# EAGLE design Main (EAGLE 9.2.2)
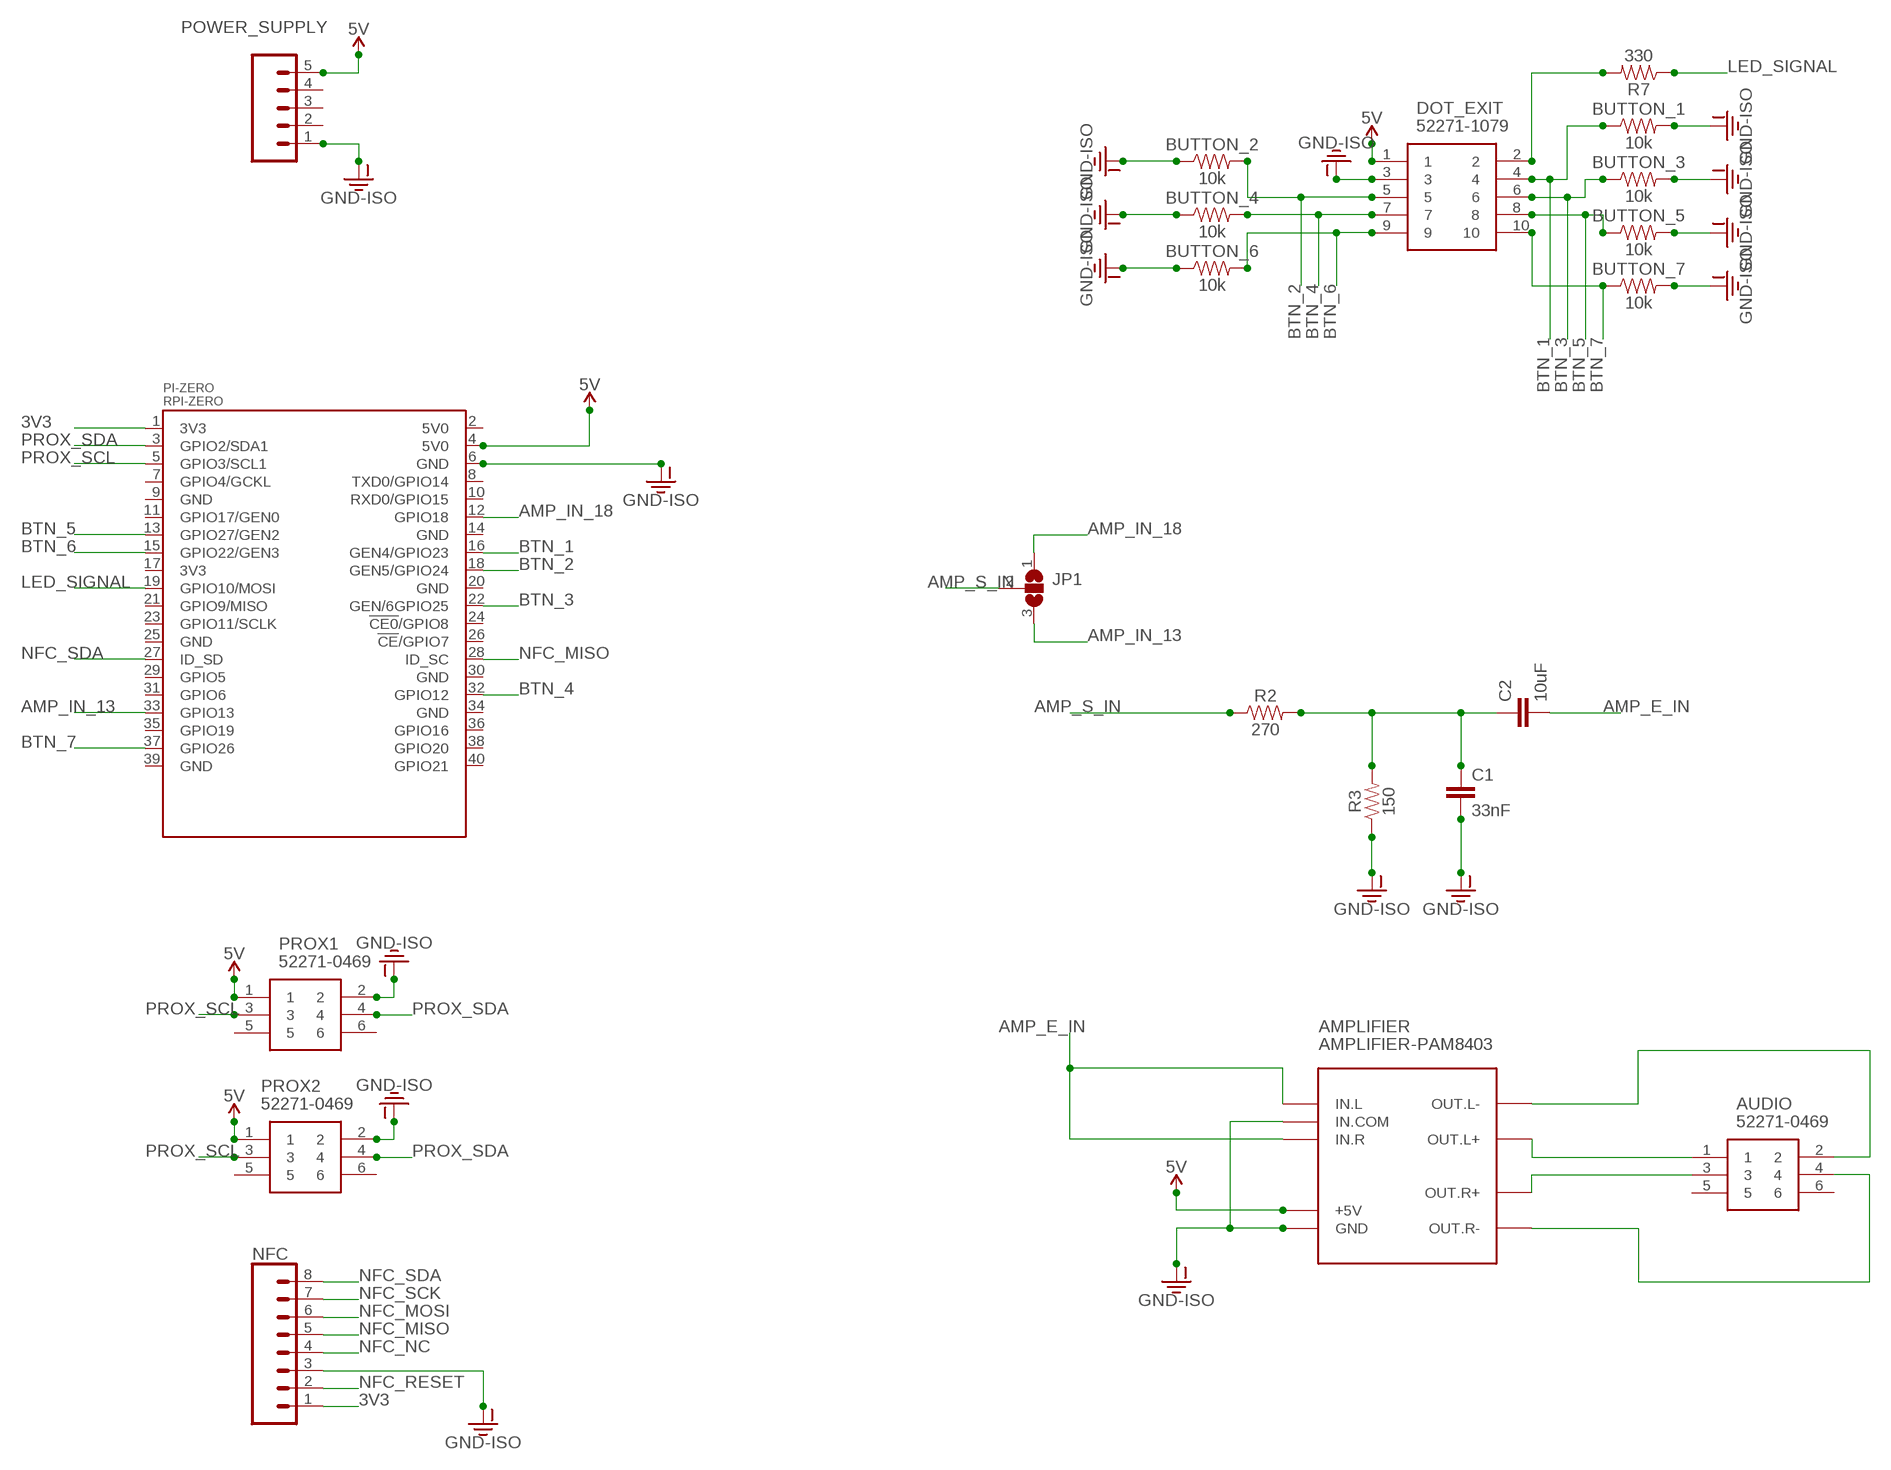
[diagram p0: schematic, sheet 1]

## Parts
AMPLIFIER  AMPLIFIER-PAM8403  [AMPLIFIER-PAM8403]
AUDIO  52271-0469  [MOLEX_52271-0469]
BUTTON_1  10k  1KOHM-HORIZ-1/4W-1%  [AXIAL-0.3]
BUTTON_2  10k  1KOHM-HORIZ-1/4W-1%  [AXIAL-0.3]
BUTTON_3  10k  1KOHM-HORIZ-1/4W-1%  [AXIAL-0.3]
BUTTON_4  10k  1KOHM-HORIZ-1/4W-1%  [AXIAL-0.3]
BUTTON_5  10k  1KOHM-HORIZ-1/4W-1%  [AXIAL-0.3]
BUTTON_6  10k  1KOHM-HORIZ-1/4W-1%  [AXIAL-0.3]
BUTTON_7  10k  1KOHM-HORIZ-1/4W-1%  [AXIAL-0.3]
C1  33nF  10NF-PTH-10MM-10000V-1-%  [CAP-PTH-10MM]
C2  10uF  10NF-PTH-10MM-10000V-1-%  [CAP-PTH-10MM]
DOT_EXIT  52271-1079  [52271-1079]
JP1  SJ2W  [SJ_2]
NFC  CONN_08"  [1X08]
PI-ZERO  RPI-ZERO  [RASPBERRYPI_BASTELSTUBE_V13_RASPI_BOARD_B+_FULL]
POWER_SUPPLY  CONN_05  [1X05]
PROX1  52271-0469  [MOLEX_52271-0469]
PROX2  52271-0469  [MOLEX_52271-0469]
R2  270  330OHM-HORIZ-1/10W-5%  [AXIAL-0.3]
R3  150  330OHM-HORIZ-1/10W-5%  [AXIAL-0.3]
R7  330  330OHM-HORIZ-1/10W-5%  [AXIAL-0.3]

## Nets
3V3: NFC.1 PI-ZERO.1(3V3)
5V [power]: AMPLIFIER.+5V DOT_EXIT.1 PI-ZERO.4(5V0) POWER_SUPPLY.5 PROX1.1 PROX2.1
AMP_E_IN: AMPLIFIER.IN.L AMPLIFIER.IN.R C2.2
AMP_IN_13: JP1.3 PI-ZERO.33(GPIO13)
AMP_IN_18: JP1.1 PI-ZERO.12(GPIO18)
AMP_S_IN: JP1.2 R2.P$1
BTN_1: BUTTON_1.P$1 DOT_EXIT.4 PI-ZERO.16(GEN4/GPIO23)
BTN_2: BUTTON_2.P$2 DOT_EXIT.5 PI-ZERO.18(GEN5/GPIO24)
BTN_3: BUTTON_3.P$1 DOT_EXIT.6 PI-ZERO.22(GEN/6GPIO25)
BTN_4: BUTTON_4.P$2 DOT_EXIT.7 PI-ZERO.32(GPIO12)
BTN_5: BUTTON_5.P$1 DOT_EXIT.8 PI-ZERO.13(GPIO27/GEN2)
BTN_6: BUTTON_6.P$2 DOT_EXIT.9 PI-ZERO.15(GPIO22/GEN3)
BTN_7: BUTTON_7.P$1 DOT_EXIT.10 PI-ZERO.37(GPIO26)
GND-ISO [power]: AMPLIFIER.GND AMPLIFIER.IN.COM BUTTON_1.P$2 BUTTON_2.P$1 BUTTON_3.P$2 BUTTON_4.P$1 BUTTON_5.P$2 BUTTON_6.P$1 BUTTON_7.P$2 C1.2 DOT_EXIT.3 NFC.3 PI-ZERO.6(GND) POWER_SUPPLY.1 PROX1.2 PROX2.2 R3.P$1
LED_SIGNAL: PI-ZERO.19(GPIO10/MOSI) R7.P$1
N$1: DOT_EXIT.2 R7.P$2
N$2: AMPLIFIER.OUT.L- AUDIO.2
N$3: AMPLIFIER.OUT.L+ AUDIO.1
N$4: C1.1 C2.1 R2.P$2 R3.P$2
N$5: AMPLIFIER.OUT.R+ AUDIO.3
N$6: AMPLIFIER.OUT.R- AUDIO.4
NFC_MISO: NFC.5 PI-ZERO.28(ID_SC)
NFC_MOSI: NFC.6
NFC_NC: NFC.4
NFC_RESET: NFC.2
NFC_SCK: NFC.7
NFC_SDA: NFC.8 PI-ZERO.27(ID_SD)
PROX_SCL: PI-ZERO.5(GPIO3/SCL1) PROX1.3 PROX2.3
PROX_SDA: PI-ZERO.3(GPIO2/SDA1) PROX1.4 PROX2.4
Unconnected: AUDIO.5 AUDIO.6 PI-ZERO.2(5V0) PI-ZERO.7(GPIO4/GCKL) PI-ZERO.8(TXD0/GPIO14) PI-ZERO.9(GND) PI-ZERO.10(RXD0/GPIO15) PI-ZERO.11(GPIO17/GEN0) PI-ZERO.14(GND) PI-ZERO.17(3V3) PI-ZERO.20(GND) PI-ZERO.21(GPIO9/MISO) PI-ZERO.23(GPIO11/SCLK) PI-ZERO.24(!CE0!/GPIO8) PI-ZERO.25(GND) PI-ZERO.26(!CE!/GPIO7) PI-ZERO.29(GPIO5) PI-ZERO.30(GND) PI-ZERO.31(GPIO6) PI-ZERO.34(GND) PI-ZERO.35(GPIO19) PI-ZERO.36(GPIO16) PI-ZERO.38(GPIO20) PI-ZERO.39(GND) PI-ZERO.40(GPIO21) POWER_SUPPLY.2 POWER_SUPPLY.3 POWER_SUPPLY.4 PROX1.5 PROX1.6 PROX2.5 PROX2.6

## Library data of the parts
AMPLIFIER = diy-modules:AMPLIFIER-PAM8403: Stereo Class-D 3W Audio Amplifier based on PAM8403 chip More details available here: http://artofcircuits.com/product/pam8403-5v-two-channel-stereo-mini-class-d-3w3w-audio-amplifier Click here to find device on ebay.com <http://www.ebay.com/sch/pam8403+mini+class+d>
AUDIO PROX1 PROX2 = 52271-0469:52271-0469: CONNECTOR, FPC, 1.0MM, 4 WAY Source: Datasheet <http://uk.rs-online.com/web/p/products/1707199>; ALLIED_NUMBER: 70374312; DESCRIPTION: CONNECTOR, FPC, 1.0MM, 4 WAY; HEIGHT: mm; MANUFACTURER_NAME: Molex; MANUFACTURER_PART_NUMBER: 52271-0469; RS_PART_NUMBER: 1707199
BUTTON_1-BUTTON_7 = SparkFun-Resistors:1KOHM: 1kΩ resistor A resistor is a passive two-terminal electrical component that implements electrical resistance as a circuit element. Resistors act to reduce current flow, and, at the same time, act to lower voltage levels within circuits. - Wikipedia; PROD_ID: RES-12182; VALUE: 1k
C1 C2 = SparkFun-Capacitors:10NF: 0.01uF/10nF/10,000pF ceramic capacitors A capacitor is a passive two-terminal electrical component used to store electrical energy temporarily in an electric field. CAP-09321; PROD_ID: CAP-09321; VALUE: 10nF
DOT_EXIT = 52271-1079:52271-1079: 1.0MM FPC R/A CONN 10 W Molex FFC/FPC SMT Series 1mm Pitch 10 Way Right Angle SMT Female FPC Connector, ZIF Bottom Contact Source: Datasheet <http://uk.rs-online.com/web/p/products/5144329P>; ALLIED_NUMBER: 70373119; DESCRIPTION: 1.0MM FPC R/A CONN 10 W Molex FFC/FPC SMT Series 1mm Pitch 10 Way Right Angle SMT Female FPC Connector, ZIF Bottom Contact; HEIGHT: mm; MANUFACTURER_NAME: Molex; MANUFACTURER_PART_NUMBER: 52271-1079; RS_PART_NUMBER: 5144329P
JP1 = jumper:SJ2W: SMD solder JUMPER
NFC = SparkFun-Connectors:CONN_08: Multi connection point. Often used as Generic Header-pin footprint for 0.1 inch spaced/style header connections On any of the 0.1 inch spaced packages, you can populate with these: Break Away Headers - Straight <https://www.sparkfun.com/products/116> (PRT-00116) Break Away Male Headers - Right Angle <https://www.sparkfun.com/products/553> (PRT-00553) Female Headers <https://www.sparkfun.com/products/115> (PRT-00115) Break Away Headers - Machine Pin <https://www.sparkfun.com/products/117> (PRT-00117) Break Away Female Headers - Swiss Machine Pin <https://www.sparkfun.com/products/743> (PRT-00743) Arduino Stackable Header - 8 Pin <https://www.sparkfun.com/products/9279> (PRT-09279) For SCREWTERMINALS and SPRING TERMINALS visit here: Screw Terimnals on SparkFun.com <https://www.sparkfun.com/search/results?term=Screw+Terminals> (5mm/3.5mm/2.54mm spacing) This device is also useful as a general connection point to wire up your design to another part of your project. Our various solder wires solder well into these plated through hole pads. Hook-Up Wire - Assortment (Stranded, 22 AWG) <https://www.sparkfun.com/products/11375> (PRT-11375) Hook-Up Wire - Assortment (Solid Core, 22 AWG) <https://www.sparkfun.com/products/11367> (PRT-11367) View the entire wire category on our website here <https://www.sparkfun.com/categories/141> Special notes: Molex polarized connector foot print use with SKU : PRT-08231 with associated crimp pins and housings. 1MM SMD Version SKU: PRT-10208 NOTES ON THE VARIANTS LOCK and LOCK_LONGPADS... This footprint was designed to help hold the alignment of a through-hole component (i.e. 6-pin header) while soldering it into place. You may notice that each hole has been shifted either up or down by 0.005 of an inch from it's more standard position (which is a perfectly straight line). This slight alteration caused the pins (the squares in the middle) to touch the edges of the holes. Because they are alternating, it causes a "brace" to hold the component in place. 0.005 has proven to be the perfect amount of "off-center" position when using our standard breakaway headers. Although looks a little odd when you look at the bare footprint, once you have a header in there, the alteration is very hard to notice. Also,if you push a header all the way into place, it is covered up entirely on the bottom side.; PROD_ID: CONN-08438
PI-ZERO = RPI-Zero-Footprint:RPI-ZERO
POWER_SUPPLY = SparkFun-Connectors:CONN_05: Multi connection point. Often used as Generic Header-pin footprint for 0.1 inch spaced/style header connections On any of the 0.1 inch spaced packages, you can populate with these: Break Away Headers - Straight <https://www.sparkfun.com/products/116> (PRT-00116) Break Away Male Headers - Right Angle <https://www.sparkfun.com/products/553> (PRT-00553) Female Headers <https://www.sparkfun.com/products/115> (PRT-00115) Break Away Headers - Machine Pin <https://www.sparkfun.com/products/117> (PRT-00117) Break Away Female Headers - Swiss Machine Pin <https://www.sparkfun.com/products/743> (PRT-00743) For SCREWTERMINALS and SPRING TERMINALS visit here: Screw Terimnals on SparkFun.com <https://www.sparkfun.com/search/results?term=Screw+Terminals> (5mm/3.5mm/2.54mm spacing) This device is also useful as a general connection point to wire up your design to another part of your project. Our various solder wires solder well into these plated through hole pads. Hook-Up Wire - Assortment (Stranded, 22 AWG) <https://www.sparkfun.com/products/11375> (PRT-11375) Hook-Up Wire - Assortment (Solid Core, 22 AWG) <https://www.sparkfun.com/products/11367> (PRT-11367) View the entire wire category on our website here <https://www.sparkfun.com/categories/141> Special notes: Molex polarized connector foot print use with SKU : PRT-08231 with associated crimp pins and housings. 1MM SMD Version SKU: PRT-10208
R2 R3 = SparkFun-Resistors:330OHM: 330Ω resistor A resistor is a passive two-terminal electrical component that implements electrical resistance as a circuit element. Resistors act to reduce current flow, and, at the same time, act to lower voltage levels within circuits. - Wikipedia; PROD_ID: RES-8371; VALUE: 330
R7 = SparkFun-Resistors:330OHM: 330Ω resistor A resistor is a passive two-terminal electrical component that implements electrical resistance as a circuit element. Resistors act to reduce current flow, and, at the same time, act to lower voltage levels within circuits. - Wikipedia; PROD_ID: RES-8371

## Net classes
0 default: width 0.254 mm, drill 0.508 mm, clearance 0.254 mm
1 power: width 0.508 mm, drill 0.635 mm, clearance 0.381 mm

## Board
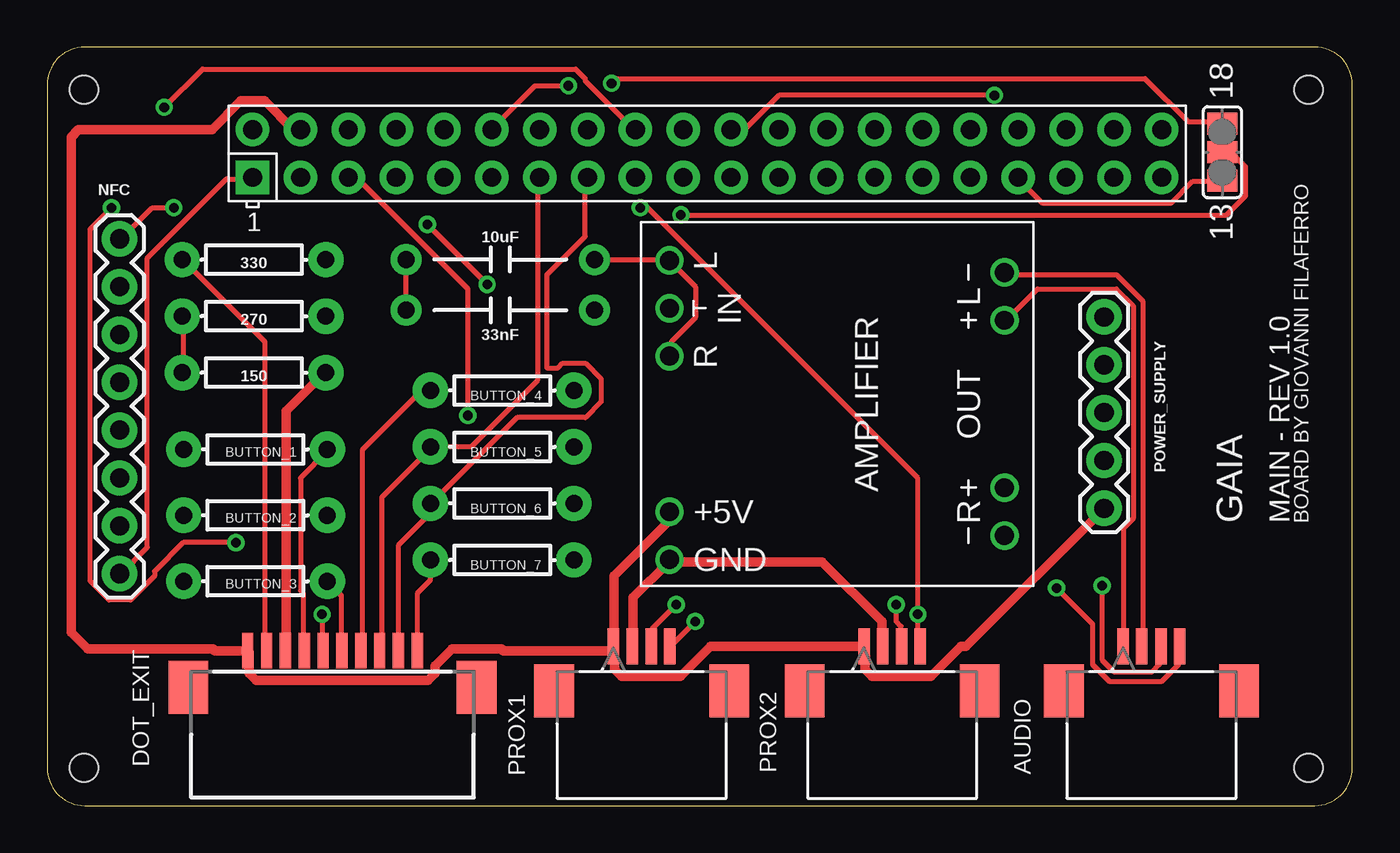
[diagram p1: board, top side]
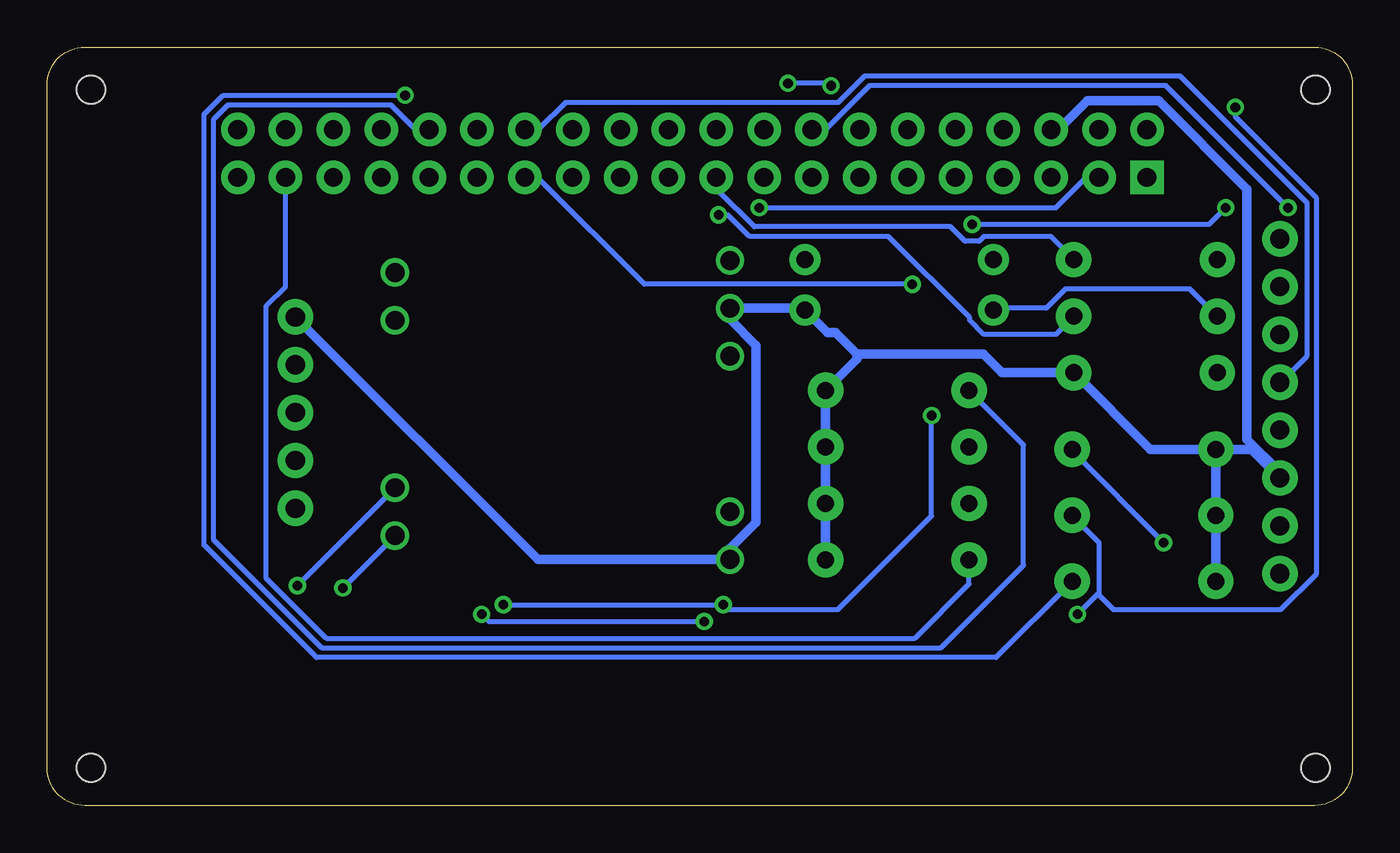
[diagram p2: board, bottom side, seen from below]

Size 69.29 x 40.27 mm. Coordinates in mm from the lower left corner, seen from the top.
Outline: 0,38.27 0,2 arc90 2,0 67.29,0 arc90 69.29,2 69.29,38.27 arc90 67.29,40.27 2,40.27 arc90 0,38.27
Copper layers (1*16): Top 0.035mm / dielectric 1.5mm / Bottom 0.035mm
Design rules "default": minimum track width 6mil, minimum drill 0.35mm, track to track 6mil, track to pad 6mil, pad to pad 6mil, via to via 6mil, smd to smd 6mil, copper to edge 40mil, drill to drill 6mil, minimum pad ring 10mil, minimum via ring 8mil, stop-mask expansion 4mil, vias tented up to drill 0mil, thermal gap 10mil
Holes 1.5 mm at 1.96,38 66.96,38 66.96,2 1.96,2

### Footprints (pad centres in the part's own frame; a part is rotated, then mirrored left to right if it is on the bottom)
AMPLIFIER-PAM8403 = drill 1: +5V 5.715,-8.89; GND 8.255,-8.89; IN.COM -5.08,-8.89; IN.L -7.62,-8.89; IN.R -2.54,-8.89; OUT.L+ -4.445,8.89; OUT.L- -6.985,8.89; OUT.R+ 4.445,8.89; OUT.R- 6.985,8.89
MOLEX_52271-0469 = smd 0.61 x 1.905: 1 1.499,4.699; 2 0.508,4.699; 3 -0.508,4.699; 4 -1.499,4.699 | smd 2.108 x 2.794: 5 -4.648,7.061; 6 4.648,7.061
AXIAL-0.3 = drill 0.9 pad 1.88: P$1 -3.81,0; P$2 3.81,0
CAP-PTH-10MM = drill 0.9 pad 1.651: 1 -5,0; 2 5,0
52271-1079 = smd 0.6 x 1.9: 1 -4.5,1.1; 2 -3.5,1.1; 3 -2.5,1.1; 4 -1.5,1.1; 5 -0.5,1.1; 6 0.5,1.1; 7 1.5,1.1; 8 2.5,1.1; 9 3.5,1.1; 10 4.5,1.1 | smd 2.1 x 2.8: 11 7.65,-0.85; 12 -7.65,-0.85
SJ_2 = smd 1.168 x 1.6: 1 -1.524,0; 2 0,0; 3 1.524,0
1X08 = drill 1.016 pad 1.88: 1 0,0; 2 2.54,0; 3 5.08,0; 4 7.62,0; 5 10.16,0; 6 12.7,0; 7 15.24,0; 8 17.78,0
RASPBERRYPI_BASTELSTUBE_V13_RASPI_BOARD_B+_FULL = drill 1 pad 1.778 square: 1 8.37,25.23 | drill 1 pad 1.778: 2 8.37,27.77; 3 10.91,25.23; 4 10.91,27.77; 5 13.45,25.23; 6 13.45,27.77; 7 15.99,25.23; 8 15.99,27.77; 9 18.53,25.23; 10 18.53,27.77; 11 21.07,25.23; 12 21.07,27.77; 13 23.61,25.23; 14 23.61,27.77; 15 26.15,25.23; 16 26.15,27.77; 17 28.69,25.23; 18 28.69,27.77; 19 31.23,25.23; 20 31.23,27.77; 21 33.77,25.23; 22 33.77,27.77; 23 36.31,25.23; 24 36.31,27.77; 25 38.85,25.23; 26 38.85,27.77; 27 41.39,25.23; 28 41.39,27.77; 29 43.93,25.23; 30 43.93,27.77; 31 46.47,25.23; 32 46.47,27.77; 33 49.01,25.23; 34 49.01,27.77; 35 51.55,25.23; 36 51.55,27.77; 37 54.09,25.23; 38 54.09,27.77; 39 56.63,25.23; 40 56.63,27.77
1X05 = drill 1.016 pad 1.88: 1 0,0; 2 2.54,0; 3 5.08,0; 4 7.62,0; 5 10.16,0

### Placement (x,y rotation side)
AMPLIFIER  41.93,21.32 270 top
AUDIO  58.62,13.15 180 top
BUTTON_1  11.06,18.91 180 top
BUTTON_2  11.06,15.41 0 top
BUTTON_3  11.06,11.91 180 top
BUTTON_4  24.16,22.04 180 top
BUTTON_5  24.16,19.04 0 top
BUTTON_6  24.16,16.04 180 top
BUTTON_7  24.16,13.04 0 top
C1  24.05,26.3 0 top
C2  24.05,28.99 0 top
DOT_EXIT  15.15,7.12 0 top
JP1  62.38,34.69 270 top
NFC  3.85,12.31 90 top
PI-ZERO  2.54,8.12 0 top
POWER_SUPPLY  56.11,25.94 270 top
PROX1  31.56,13.15 180 top
PROX2  44.86,13.15 180 top
R2  10.98,25.98 180 top
R3  10.98,22.98 180 top
R7  10.98,28.98 180 top

### Tracks (layer width: path | path; a pad name or v marks a point on that pad's centre or on a via)
3V3
  Top 0.254: PI-ZERO.1 10.79,33.27 9.52,33.27 5.33,29.07 5.33,13.71 3.93,12.31 NFC.1
5V
  Top 0.508: POWER_SUPPLY.5 48.78,8.45 48.51,8.45 46.93,6.86 43.78,6.86 43.41,7.23 43.41,8.4 PROX2.1 35.21,8.45 33.63,6.86 30.48,6.86 30.11,7.23 30.11,8.4 PROX1.1 | PROX1.1 29.83,8.22 24.2,8.22 24.11,8.3 21.49,8.3 20.59,7.4 20.59,7.01 20.21,6.63 11.09,6.63 10.71,7.01 10.71,8.16 DOT_EXIT.1 8.9,8.22 8.81,8.3 2.16,8.3 1.27,9.19 1.27,35.5 1.66,35.89 8.75,35.89 10.28,37.41 11.54,37.41 13.07,35.89 PI-ZERO.4 | AMPLIFIER.+5V 33.01,15.49 33.01,15.11 30.09,12.18 30.09,8.63 PROX1.1
AMP_E_IN
  Top 0.254: AMPLIFIER.IN.R 33.14,23.87 33.14,24.63 34.41,25.9 34.41,27.55 33.14,28.82 AMPLIFIER.IN.L 33.01,28.95 29.07,28.95 C2.2
AMP_IN_13
  Top 0.254: JP1.3 62.35,33.14 60.83,33.14 59.68,32 52.82,32 51.55,33.27 PI-ZERO.33
AMP_IN_18  (via drill 0.51)
  Top 0.254: v29.96,38.35 30.22,38.6 58.29,38.6 60.57,36.31 62.35,36.31 JP1.1 | v27.68,38.22 25.9,38.22 23.61,35.93 PI-ZERO.12
  Bottom 0.254: v29.96,38.35 27.8,38.35 v27.68,38.22
AMP_S_IN  (via drill 0.51)
  Top 0.254: v33.65,31.36 62.6,31.36 63.62,32.38 63.62,33.9 62.86,34.66 62.48,34.66 JP1.2
  Bottom 0.254: v33.65,31.36 33.14,31.36 32,30.22 24.63,30.22 20.31,25.9 20.31,25.77 19.55,25.01 15.74,25.01 14.85,25.9 R2.P$1
BTN_1  (via drill 0.51)
  Top 0.254: DOT_EXIT.4 13.58,8.25 13.58,11.29 13.45,11.42 13.45,17.39 14.85,18.79 BUTTON_1.P$1 | v3.42,31.74 2.28,30.6 2.28,11.93 3.29,10.91 4.44,10.91 5.71,12.18 5.71,12.44 7.23,13.96 v10.02,13.96
  Bottom 0.254: v3.42,31.74 9.9,38.22 25.65,38.22 27.93,35.93 28.57,35.93 PI-ZERO.16 | v10.02,13.96 14.85,18.79 BUTTON_1.P$1
BTN_2  (via drill 0.51)
  Top 0.254: v14.6,10.15 14.6,8.25 DOT_EXIT.5 | v6.22,37.08 8.25,39.11 28.06,39.11 28.57,38.6 28.57,38.47 31.11,35.93 PI-ZERO.18
  Bottom 0.254: 13.52,11.23 13.45,11.29 13.45,13.96 14.85,15.36 BUTTON_2.P$2 | 13.52,11.23 v14.6,10.15 | v6.22,37.08 6.22,36.57 1.9,32.25 1.9,12.31 3.8,10.41 12.69,10.41 13.52,11.23
BTN_3  (via drill 0.51)
  Top 0.254: DOT_EXIT.6 15.61,8.25 15.61,11.17 14.98,11.8 BUTTON_3.P$1 | v50.28,37.71 38.85,37.71 37.08,35.93 36.31,35.93 PI-ZERO.22
  Bottom 0.254: v50.28,37.71 59.94,37.71 60.95,36.7 60.95,13.84 54.98,7.87 18.91,7.87 14.98,11.8 BUTTON_3.P$1
BTN_4
  Top 0.254: DOT_EXIT.7 16.76,8.25 16.76,18.91 19.88,22.04 BUTTON_4.P$2
  Bottom 0.254: PI-ZERO.32 49.01,35.93 49.78,35.93 51.05,37.2 59.68,37.2 60.44,36.44 60.44,14.09 54.73,8.37 21.84,8.37 17.46,12.75 17.46,19.15 BUTTON_4.P$2
BTN_5
  Top 0.254: DOT_EXIT.8 17.77,8.25 17.77,16.38 20.35,18.95 BUTTON_5.P$1 22.5,19.04 26.03,22.57 26.03,33.27 PI-ZERO.13
BTN_6
  Top 0.254: DOT_EXIT.9 18.66,8.25 18.66,13.84 20.35,15.52 20.35,16 | PI-ZERO.15 28.57,33.27 28.57,30.22 26.54,28.19 26.54,23.23 27.12,23.23 27.37,23.49 28.57,23.49 29.42,22.64 29.42,21.44 28.57,20.59 24.94,20.59 20.35,16 | 20.35,16 BUTTON_6.P$2
BTN_7
  Top 0.254: DOT_EXIT.10 19.68,8.25 19.68,11.29 20.35,11.97 BUTTON_7.P$1
  Bottom 0.254: PI-ZERO.37 56.63,33.27 56.63,27.55 57.65,26.54 57.65,12.06 54.48,8.88 23.23,8.88 20.35,11.77 BUTTON_7.P$1
GND-ISO
  Top 0.508: 12.59,8.29 DOT_EXIT.3 12.69,8.5 12.69,20.95 14.72,22.98 R3.P$1 | PROX1.2 31.11,8.5 31.11,11.04 33.01,12.95 AMPLIFIER.GND 33.27,12.95 41.14,12.95 44.31,9.77 44.31,8.5 PROX2.2
  Bottom 0.508: POWER_SUPPLY.1 43.23,13.06 AMPLIFIER.GND 33.04,13.64 31.65,15.03 31.65,24.43 33.04,25.82 AMPLIFIER.IN.COM 29.15,26.4 C1.2 27.87,25.12 27.43,25.12 26.3,23.98 | PI-ZERO.6 15.61,35.89 14.08,37.41 10.28,37.41 5.59,32.73 5.59,19.45 3.85,17.7 NFC.3 5.37,18.91 BUTTON_1.P$2 | BUTTON_1.P$2 BUTTON_2.P$1 BUTTON_3.P$2 | BUTTON_1.P$2 10.71,18.91 R3.P$1 18.6,22.98 19.6,23.98 26.3,23.98 | 26.3,23.98 26.3,23.71 BUTTON_4.P$1 BUTTON_5.P$2 BUTTON_6.P$1 BUTTON_7.P$2
LED_SIGNAL
  Bottom 0.254: PI-ZERO.19 33.65,33.27 33.65,32.63 31.74,30.73 21.33,30.73 20.57,29.96 19.8,29.96 19.55,30.22 15.99,30.22 14.85,29.07 R7.P$1
N$1
  Top 0.254: DOT_EXIT.2 11.55,8.25 11.55,24.63 7.23,28.95 R7.P$2
N$2
  Top 0.254: AUDIO.2 58.16,8.5 58.16,26.79 56.76,28.19 50.92,28.19 AMPLIFIER.OUT.L-
N$3
  Top 0.254: AUDIO.1 57.14,8.5 57.14,14.72 57.65,15.23 57.65,26.54 56.76,27.42 52.57,27.42 50.92,25.77 AMPLIFIER.OUT.L+
N$4
  Top 0.254: C1.1 19.04,26.41 19.04,28.95 C2.1 | R3.P$2 7.23,23.11 7.23,25.9 R2.P$2
  Bottom 0.254: C1.1 19.04,26.41 16.25,26.41 15.23,27.42 8.63,27.42 7.23,26.03 R2.P$2
N$5  (via drill 0.51)
  Top 0.254: v56,11.68 56,7.74 56.63,7.1 58.67,7.1 59.05,7.49 59.05,8.37 AUDIO.3
  Bottom 0.254: v56,11.68 50.92,16.76 AMPLIFIER.OUT.R+
N$6  (via drill 0.51)
  Top 0.254: v53.59,11.55 55.49,9.64 55.49,7.49 56.38,6.6 59.17,6.6 60.06,7.49 60.06,8.37 AUDIO.4
  Bottom 0.254: v53.59,11.55 50.92,14.22 AMPLIFIER.OUT.R-
NFC_MISO
  Bottom 0.254: PI-ZERO.28 43.81,35.93 43.17,35.93 41.77,37.33 27.3,37.33 25.9,38.73 9.14,38.73 2.41,32 2.41,23.87 3.8,22.47 NFC.5
NFC_SDA  (via drill 0.51)
  Top 0.254: v20.19,30.85 v23.36,27.68 | v6.72,31.74 5.58,31.74 3.93,30.09 NFC.8
  Bottom 0.254: v23.36,27.68 37.58,27.68 43.17,33.27 43.81,33.27 PI-ZERO.27 | v20.19,30.85 7.61,30.85 v6.72,31.74
PROX_SCL  (via drill 0.51)
  Top 0.254: v33.39,10.66 32.12,9.39 32.12,8.5 PROX1.3 | v45.08,10.66 45.08,9.77 45.33,9.52 45.33,8.5 PROX2.3 | v22.34,20.71 22.34,27.43 16.5,33.27 15.99,33.27 PI-ZERO.5
  Bottom 0.254: v45.08,10.66 v33.39,10.66 33.14,10.41 27.3,10.41 22.34,15.37 v22.34,20.71
PROX_SDA  (via drill 0.51)
  Top 0.254: v34.41,9.77 33.14,8.5 PROX1.4 | PROX2.4 46.35,8.5 46.22,8.63 v46.22,10.15 46.22,17.39 31.87,31.74 v31.49,31.74
  Bottom 0.254: v34.41,9.77 45.84,9.77 v46.22,10.15 | v31.49,31.74 15.74,31.74 14.22,33.27 13.45,33.27 PI-ZERO.3

### Text on the board
tNames: 18 | 13 | BUTTON_4 | BUTTON_1 | BUTTON_5 | BUTTON_6 | BUTTON_2 | GAIA | MAIN - REV 1.0 | BOARD BY GIOVANNI FILAFERRO | BUTTON_7 | BUTTON_3